# Altium schematic sheet Memmory Address Register.SchDoc
size B; Author: E. Sims; Organization: Let's Build Rockets Inc.; SheetNumber: 2; SheetTotal: 2
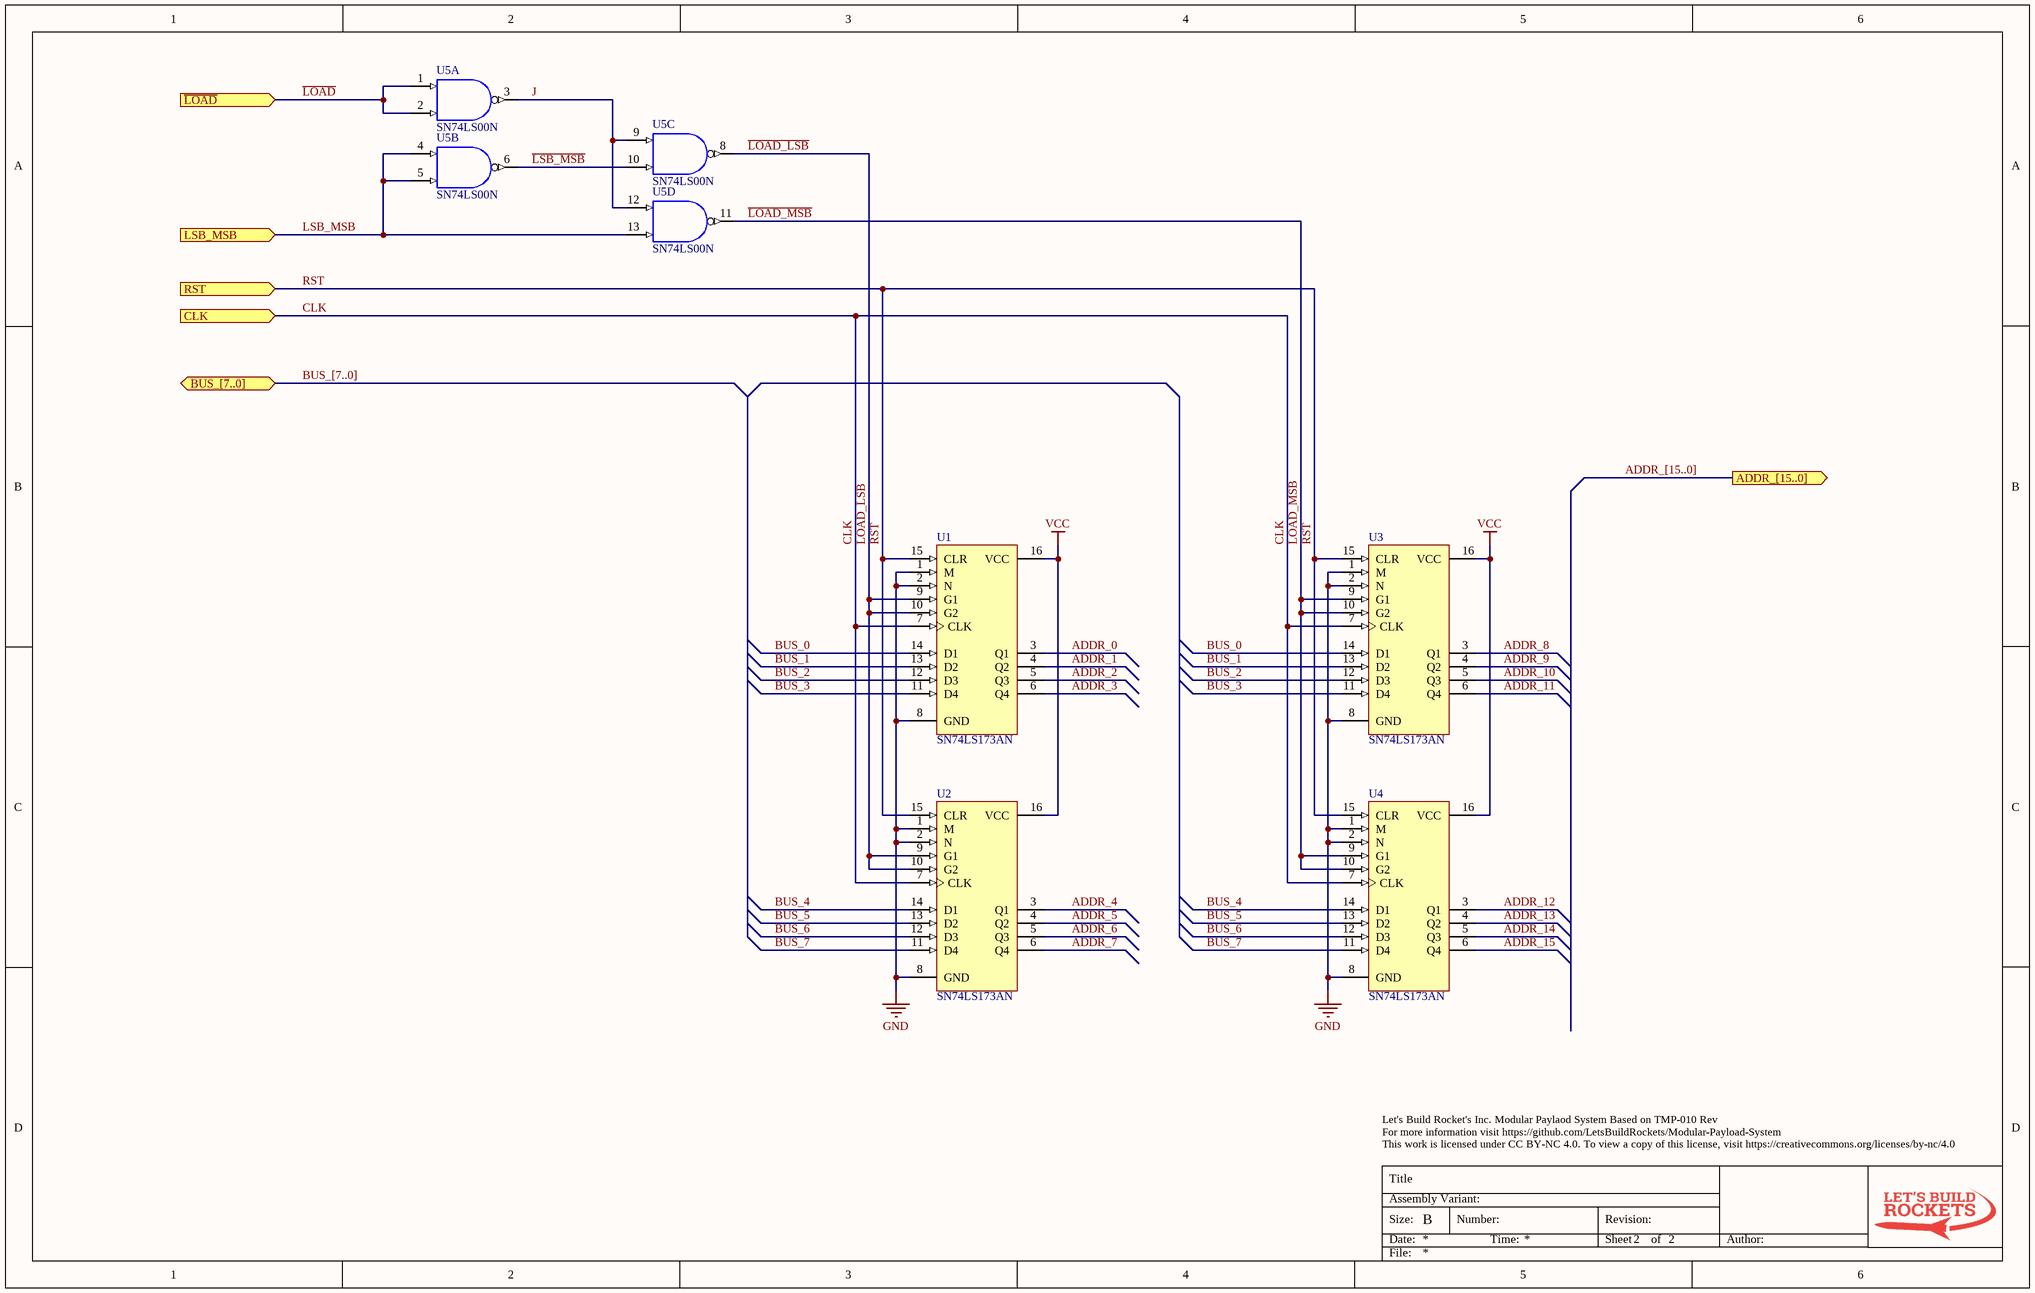
[diagram p0: Memmory Address Register.SchDoc]

## Parts
U1  SN74LS173AN  [N016D]
U2  SN74LS173AN  [N016D]
U3  SN74LS173AN  [N016D]
U4  SN74LS173AN  [N016D]
U5  SN74LS00N  [N014]  (parts A,B,C,D of 4)

## Ports
ADDR_[15..0] (out), BUS_[7..0] (bidir), CLK (in), LSB_MSB (in), RST (in), ~{LOAD} (in)

## Nets
GND: U1.1(M) U1.2(N) U1.8(GND) U2.1(M) U2.2(N) U2.8(GND) U3.1(M) U3.2(N) U3.8(GND) U4.1(M) U4.2(N) U4.8(GND) U5.7(GND)
VCC: U1.16(VCC) U2.16(VCC) U3.16(VCC) U4.16(VCC) U5.14(VCC)
ADDR_0: U1.3(Q1)
ADDR_1: U1.4(Q2)
ADDR_2: U1.5(Q3)
ADDR_3: U1.6(Q4)
ADDR_4: U2.3(Q1)
ADDR_5: U2.4(Q2)
ADDR_6: U2.5(Q3)
ADDR_7: U2.6(Q4)
ADDR_8: U3.3(Q1)
ADDR_9: U3.4(Q2)
ADDR_10: U3.5(Q3)
ADDR_11: U3.6(Q4)
ADDR_12: U4.3(Q1)
ADDR_13: U4.4(Q2)
ADDR_14: U4.5(Q3)
ADDR_15: U4.6(Q4)
BUS_0: U1.14(D1) U3.14(D1)
BUS_1: U1.13(D2) U3.13(D2)
BUS_2: U1.12(D3) U3.12(D3)
BUS_3: U1.11(D4) U3.11(D4)
BUS_4: U2.14(D1) U4.14(D1)
BUS_5: U2.13(D2) U4.13(D2)
BUS_6: U2.12(D3) U4.12(D3)
BUS_7: U2.11(D4) U4.11(D4)
CLK: U1.7(CLK) U2.7(CLK) U3.7(CLK) U4.7(CLK) ; port CLK
J: U5.3(Y) U5.9(A) U5.12(A)
~{LOAD}: U5.1(A) U5.2(B) ; port ~{LOAD}
~{LOAD_LSB}: U1.9(G1) U1.10(G2) U2.9(G1) U2.10(G2) U5.8(Y)
~{LOAD_MSB}: U3.9(G1) U3.10(G2) U4.9(G1) U4.10(G2) U5.11(Y)
~{LSB_MSB}: U5.6(Y) U5.10(B)
LSB_MSB: U5.4(A) U5.5(B) U5.13(B) ; port LSB_MSB
RST: U1.15(CLR) U2.15(CLR) U3.15(CLR) U4.15(CLR) ; port RST

## Buses and harness runs
bus ADDR_[15..0] = port ADDR_[15..0]
bus BUS_[7..0] = port BUS_[7..0]

## Notes on the sheet
- Let's Build Rocket's Inc. Modular Paylaod System Based on TMP-010 Rev
  For more information visit https://github.com/LetsBuildRockets/Modular-Payload-System
  This work is licensed under CC BY-NC 4.0. To view a copy of this license, visit https://creativecommons.org/licenses/by-nc/4.0
- Title
- Size:
- Date:
- Assembly Variant:
- B
- Number:
- Time:
- Revision:
- Sheet
- of
- Author:
- File:

## Library data of the parts
U1-U4 = SN74LS173AN: 4-Bit D-Type Register with 3-State Outputs; Published: 8-Jun-2000; LatestRevisionDate: 04-Mar-2005; LatestRevisionNote: Stylized 3D Model Added.; DatasheetVersion: Mar-1988; PackageVersion: Oct-1995; PackageReference: N016D; Publisher: Altium Limited; PackageDescription: DIP; 16 Leads; Row Spacing 7.62 mm; Pitch 2.54 mm; Code_JEDEC: MS-001-BB; ComponentLink1Description: Manufacturer Link; ComponentLink1URL: http://www.ti.com/; ComponentLink2Description: Datasheet; ComponentLink2URL: http://www-s.ti.com/sc/ds/sn74ls173a.pdf
U5 = SN74LS00N: Quadruple 2-Input Positive-NAND Gate; Published: 8-Jun-2000; LatestRevisionDate: 04-Mar-2005; LatestRevisionNote: Stylized 3D Model Added.; DatasheetVersion: Mar-1988; PackageVersion: Oct-1995; PackageReference: N014; Publisher: Altium Limited; PackageDescription: DIP; 14 Leads; Row Spacing 7.62 mm; Pitch 2.54 mm; ComponentLink1Description: Manufacturer Link; ComponentLink1URL: http://www.ti.com/; ComponentLink2Description: Datasheet; ComponentLink2URL: http://www-s.ti.com/sc/ds/sn74ls00.pdf